# EAGLE design SDIDKII-LCD(FB4) (EAGLE 5.11)
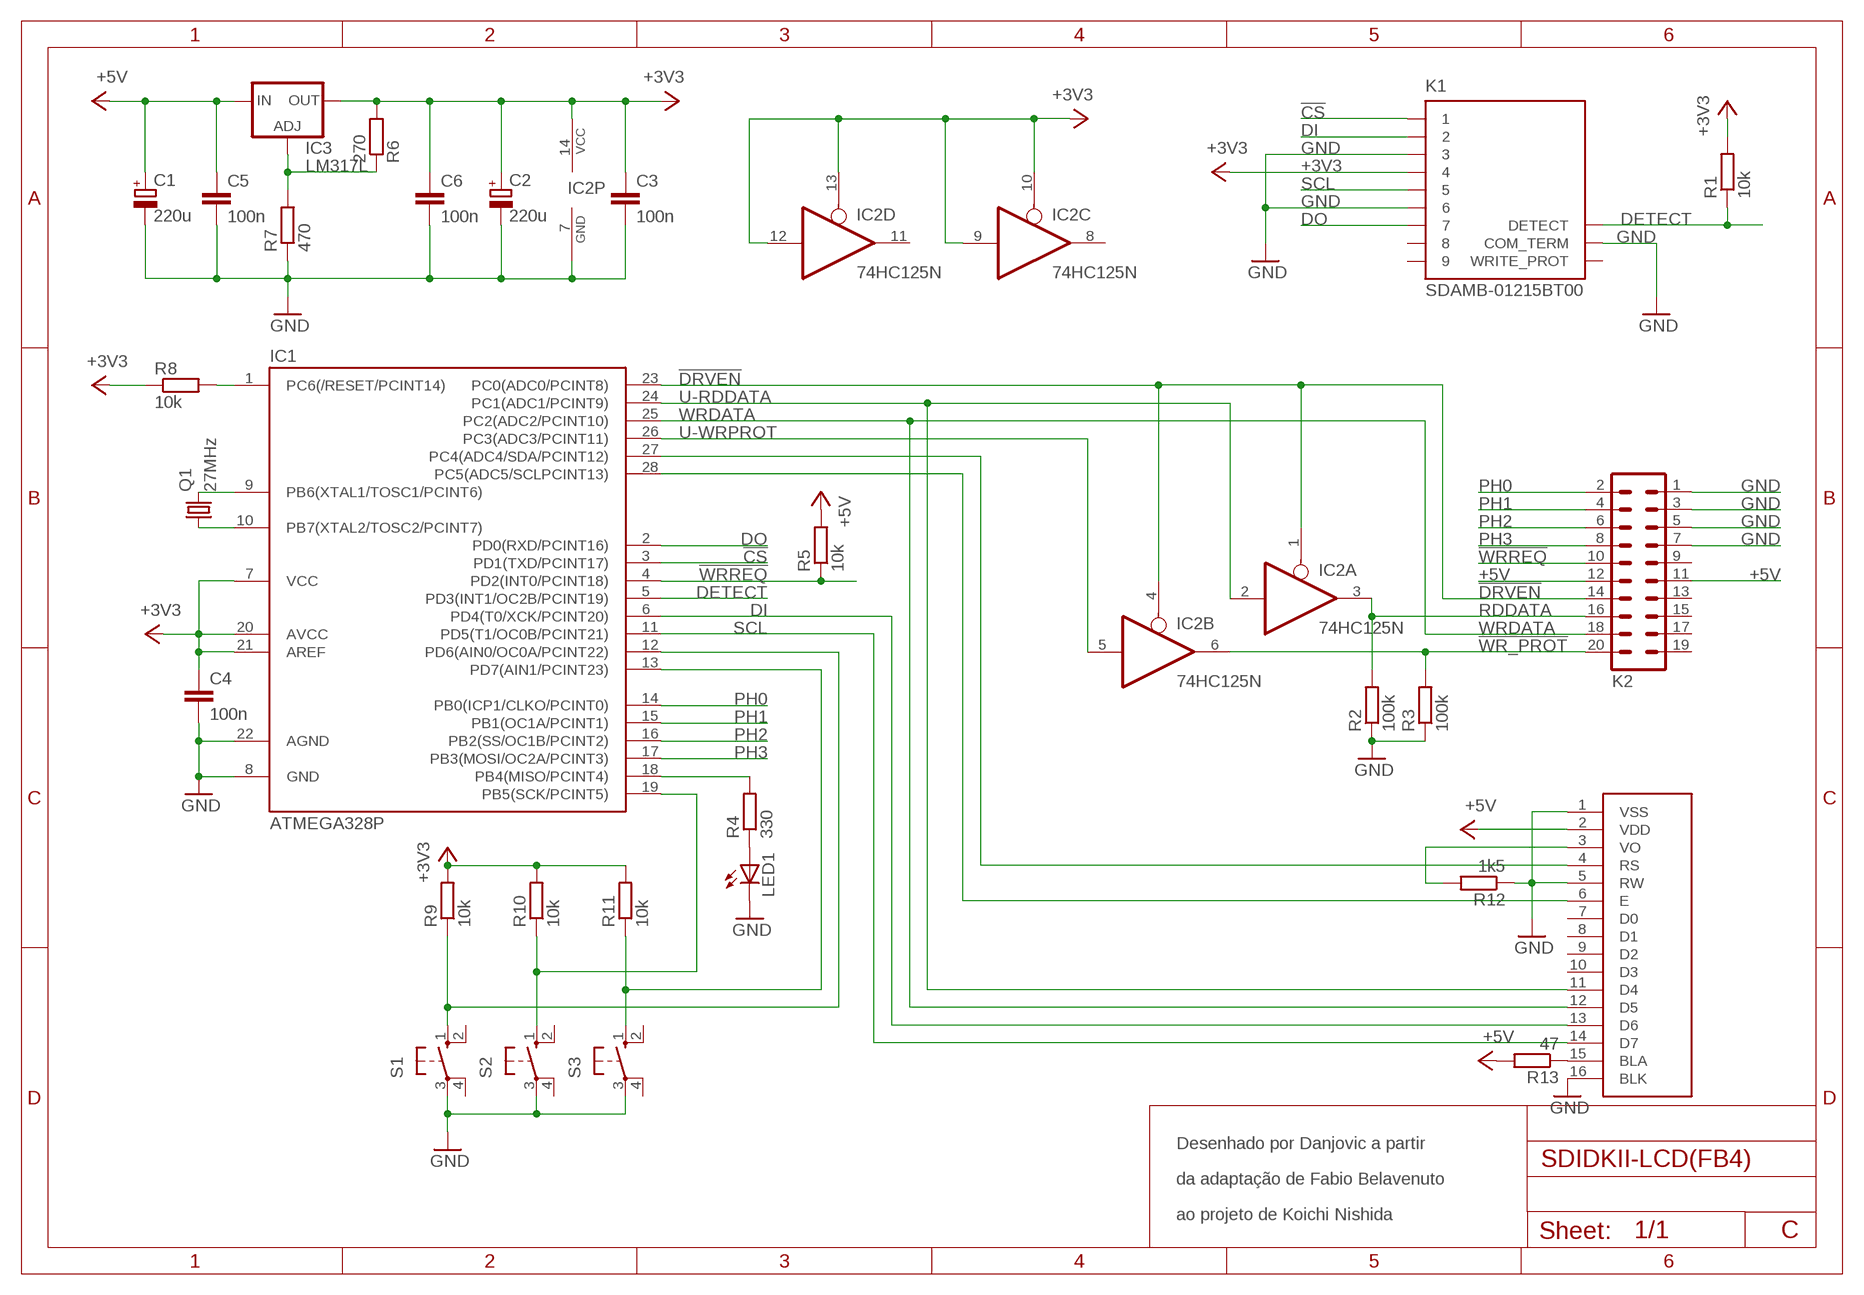
[diagram p0: schematic, sheet 1]

## Parts
C1  220u  CPOL-EUE2.5-6  [E2,5-6]
C2  220u  CPOL-EUE2.5-6  [E2,5-6]
C3  100n  C-EU050-025X075  [C050-025X075]
C4  100n  C-EU050-025X075  [C050-025X075]
C5  100n  C-EU050-025X075  [C050-025X075]
C6  100n  C-EU050-025X075  [C050-025X075]
IC1  ATMEGA328P  ATMEGA48/88/168-PU  [DIL28-3]
IC2  74HC125N  74LS125N  [DIL14]
IC3  LM317L  [317L]
K1  SDAMB-01215BT00  FPS009-3000  [FPS009-3000]
K2  ML20  [ML20]
LED1  LED3MM  [LED3MM]
Q1  27MHz  CRYSTALHC49S  [HC49/S]
R1  10k  R-EU_0207/7  [0207/7]
R2  100k  R-EU_0207/7  [0207/7]
R3  100k  R-EU_0207/7  [0207/7]
R4  330  R-EU_0207/7  [0207/7]
R5  10k  R-EU_0207/7  [0207/7]
R6  270  R-EU_0207/7  [0207/7]
R7  470  R-EU_0207/7  [0207/7]
R8  10k  R-EU_0207/7  [0207/7]
R9  10k  R-EU_0207/7  [0207/7]
R10  10k  R-EU_0207/7  [0207/7]
R11  10k  R-EU_0207/7  [0207/7]
R12  1k5  R-EU_0207/7  [0207/7]
R13  47  R-EU_0207/7  [0207/7]
S1  10-XX  [B3F-10XX]
S2  10-XX  [B3F-10XX]
S3  10-XX  [B3F-10XX]
U$1  2X16LCDTOP  [2X16LCDTOP]

## Nets
!CS: IC1.3(PD1(TXD/PCINT17)) K1.1
!DRVEN: IC1.23(PC0(ADC0/PCINT8)) IC2.1(A:OE) IC2.4(B:OE) K2.14
!WR_PROT: IC2.6(B:O) K2.20 R3.2
!WRREQ: IC1.4(PD2(INT0/PCINT18)) K2.10 R5.1
+3V3: C2.+ C3.1 C4.1 C6.1 IC1.7(VCC) IC1.20(AVCC) IC1.21(AREF) IC2.9(C:I) IC2.10(C:OE) IC2.12(D:I) IC2.13(D:OE) IC2.14(P:VCC) IC3.2(OUT) K1.4 R1.2 R6.2 R8.1 R9.2 R10.2 R11.2
+5V: C1.+ C5.1 IC3.3(IN) K2.11 K2.12 R5.2 R13.2 U$1.2(VDD)
ADJ: IC3.1(ADJ) R6.1 R7.2
DETECT: IC1.5(PD3(INT1/OC2B/PCINT19)) K1.DETECT R1.1
DI: IC1.6(PD4(T0/XCK/PCINT20)) K1.2 U$1.13(D6)
DO: IC1.2(PD0(RXD/PCINT16)) K1.7
GND: C1.- C2.- C3.2 C4.2 C5.2 C6.2 IC1.8(GND) IC1.22(AGND) IC2.7(P:GND) K1.3 K1.6 K1.COM_TERM K2.1 K2.3 K2.5 K2.7 LED1.K(C) R2.1 R3.1 R7.1 R12.1 S1.3(P) S2.3(P) S3.3(P) U$1.1(VSS) U$1.5(RW) U$1.16(BLK)
K: LED1.A R4.1
LED: IC1.18(PB4(MISO/PCINT4)) R4.2
N$1: IC1.19(PB5(SCK/PCINT5)) R10.1 S2.1(S)
N$2: IC1.13(PD7(AIN1/PCINT23)) R11.1 S3.1(S)
N$3: R13.1 U$1.15(BLA)
N$6: IC1.1(PC6(/RESET/PCINT14)) R8.2
N$8: IC1.28(PC5(ADC5/SCLPCINT13)) U$1.6(E)
N$9: IC1.27(PC4(ADC4/SDA/PCINT12)) U$1.4(RS)
N$10: R12.2 U$1.3(VO)
PH0: IC1.14(PB0(ICP1/CLKO/PCINT0)) K2.2
PH1: IC1.15(PB1(OC1A/PCINT1)) K2.4
PH2: IC1.16(PB2(SS/OC1B/PCINT2)) K2.6
PH3: IC1.17(PB3(MOSI/OC2A/PCINT3)) K2.8
RDDATA: IC2.3(A:O) K2.16 R2.2
SCL: IC1.11(PD5(T1/OC0B/PCINT21)) K1.5 U$1.14(D7)
SW: IC1.12(PD6(AIN0/OC0A/PCINT22)) R9.1 S1.1(S)
U-RDDATA: IC1.24(PC1(ADC1/PCINT9)) IC2.2(A:I) U$1.11(D4)
U-WRPROT: IC1.26(PC3(ADC3/PCINT11)) IC2.5(B:I)
WRDATA: IC1.25(PC2(ADC2/PCINT10)) K2.18 U$1.12(D5)
X1: IC1.9(PB6(XTAL1/TOSC1/PCINT6)) Q1.2
X2: IC1.10(PB7(XTAL2/TOSC2/PCINT7)) Q1.1
Unconnected: IC2.8(C:O) IC2.11(D:O) K1.8 K1.9 K1.WRITE_PROT K2.9 K2.13 K2.15 K2.17 K2.19 S1.2(S1) S1.4(P1) S2.2(S1) S2.4(P1) S3.2(S1) S3.4(P1) U$1.7(D0) U$1.8(D1) U$1.9(D2) U$1.10(D3)

## Notes on the sheet
- Desenhado por Danjovic a partir
- da adaptação de Fabio Belavenuto
- ao projeto de Koichi Nishida
- C

## Library data of the parts
C1 C2 = rcl:CPOL-EU: POLARIZED CAPACITOR, European symbol
C3-C6 = rcl:C-EU: CAPACITOR, European symbol
IC1 = atmega8:ATMEGA48/88/168-PU
IC2 = 74xx-us:74*125: Quad bus BUFFER, 3-state
IC3 = v-reg:LM317L: VOLTAGE REGULATOR
K1 = con-yamaichi:FPS009-300*: SD Card and MMC Reader (Manual Insertion) Source: http://www.yamaichi.de/pdf/c_fps009_3000.pdf; OC_FARNELL: unknown; OC_NEWARK: unknown
K2 = con-harting-ml:ML20: HARTING; OC_FARNELL: unknown; OC_NEWARK: unknown
LED1 = led:LED: LED OSRAM: - CHIPLED LG R971, LG N971, LY N971, LG Q971, LY Q971, LO R971, LY R971 LH N974, LH R974 LS Q976, LO Q976, LY Q976 LO Q996 - Hyper CHIPLED LW Q18S LB Q993, LB Q99A, LB R99A - SideLED LS A670, LO A670, LY A670, LG A670, LP A670 LB A673, LV A673, LT A673, LW A673 LH A674 LY A675 LS A676, LA A676, LO A676, LY A676, LW A676 LS A679, LY A679, LG A679 - Hyper Micro SIDELED® LS Y876, LA Y876, LO Y876, LY Y876 LT Y87S - SmartLED LW L88C, LW L88S LB L89C, LB L89S, LG L890 LS L89K, LO L89K, LY L89K LS L896, LA L896, LO L896, LY L896 - TOPLED LS T670, LO T670, LY T670, LG T670, LP T670 LSG T670, LSP T670, LSY T670, LOP T670, LYG T670 LG T671, LOG T671, LSG T671 LB T673, LV T673, LT T673, LW T673 LH T674 LS T676, LA T676, LO T676, LY T676, LB T676, LH T676, LSB T676, LW T676 LB T67C, LV T67C, LT T67C, LS T67K, LO T67K, LY T67K, LW E67C LS E67B, LA E67B, LO E67B, LY E67B, LB E67C, LV E67C, LT E67C LW T67C LS T679, LY T679, LG T679 LS T770, LO T770, LY T770, LG T770, LP T770 LB T773, LV T773, LT T773, LW T773 LH T774 LS E675, LA E675, LY E675, LS T675 LS T776, LA T776, LO T776, LY T776, LB T776 LHGB T686 LT T68C, LB T68C - Hyper Mini TOPLED® LB M676 - Mini TOPLED Santana® LG M470 LS M47K, LO M47K, LY M47K Source: http://www.osram.convergy.de LUXEON: - LUMILED® LXK2-PW12-R00, LXK2-PW12-S00, LXK2-PW14-U00, LXK2-PW14-V00 LXK2-PM12-R00, LXK2-PM12-S00, LXK2-PM14-U00 LXK2-PE12-Q00, LXK2-PE12-R00, LXK2-PE12-S00, LXK2-PE14-T00, LXK2-PE14-U00 LXK2-PB12-K00, LXK2-PB12-L00, LXK2-PB12-M00, LXK2-PB14-N00, LXK2-PB14-P00, LXK2-PB14-Q00 LXK2-PR12-L00, LXK2-PR12-M00, LXK2-PR14-Q00, LXK2-PR14-R00 LXK2-PD12-Q00, LXK2-PD12-R00, LXK2-PD12-S00 LXK2-PH12-R00, LXK2-PH12-S00 LXK2-PL12-P00, LXK2-PL12-Q00, LXK2-PL12-R00 Source: www.luxeon.com KINGBRIGHT: KA-3528ASYC Source: www.kingbright.com
Q1 = crystal:CRYSTAL: CRYSTAL; OC_FARNELL: 1667008; OC_NEWARK: unknown
R1-R13 = rcl:R-EU_: RESISTOR, European symbol
S1-S3 = switch-omron:10-XX: OMRON SWITCH; MPN: B3F-1000; OC_FARNELL: 176432; OC_NEWARK: 36M3542
U$1 = lcd_modules_ece:2X16LCDTOP

## Board
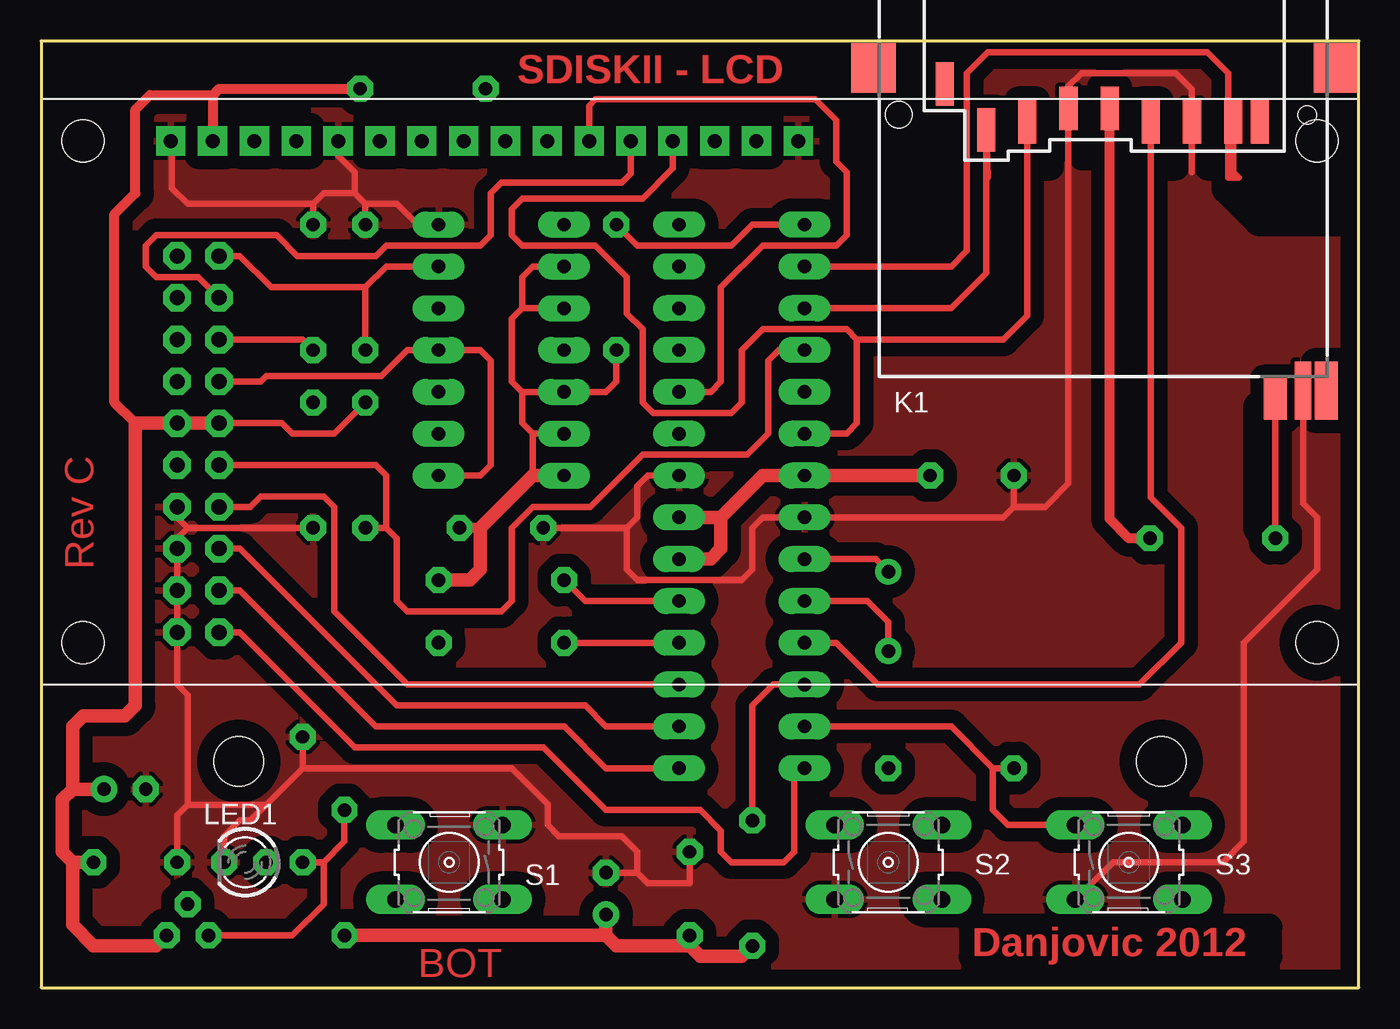
[diagram p1: board, top side]
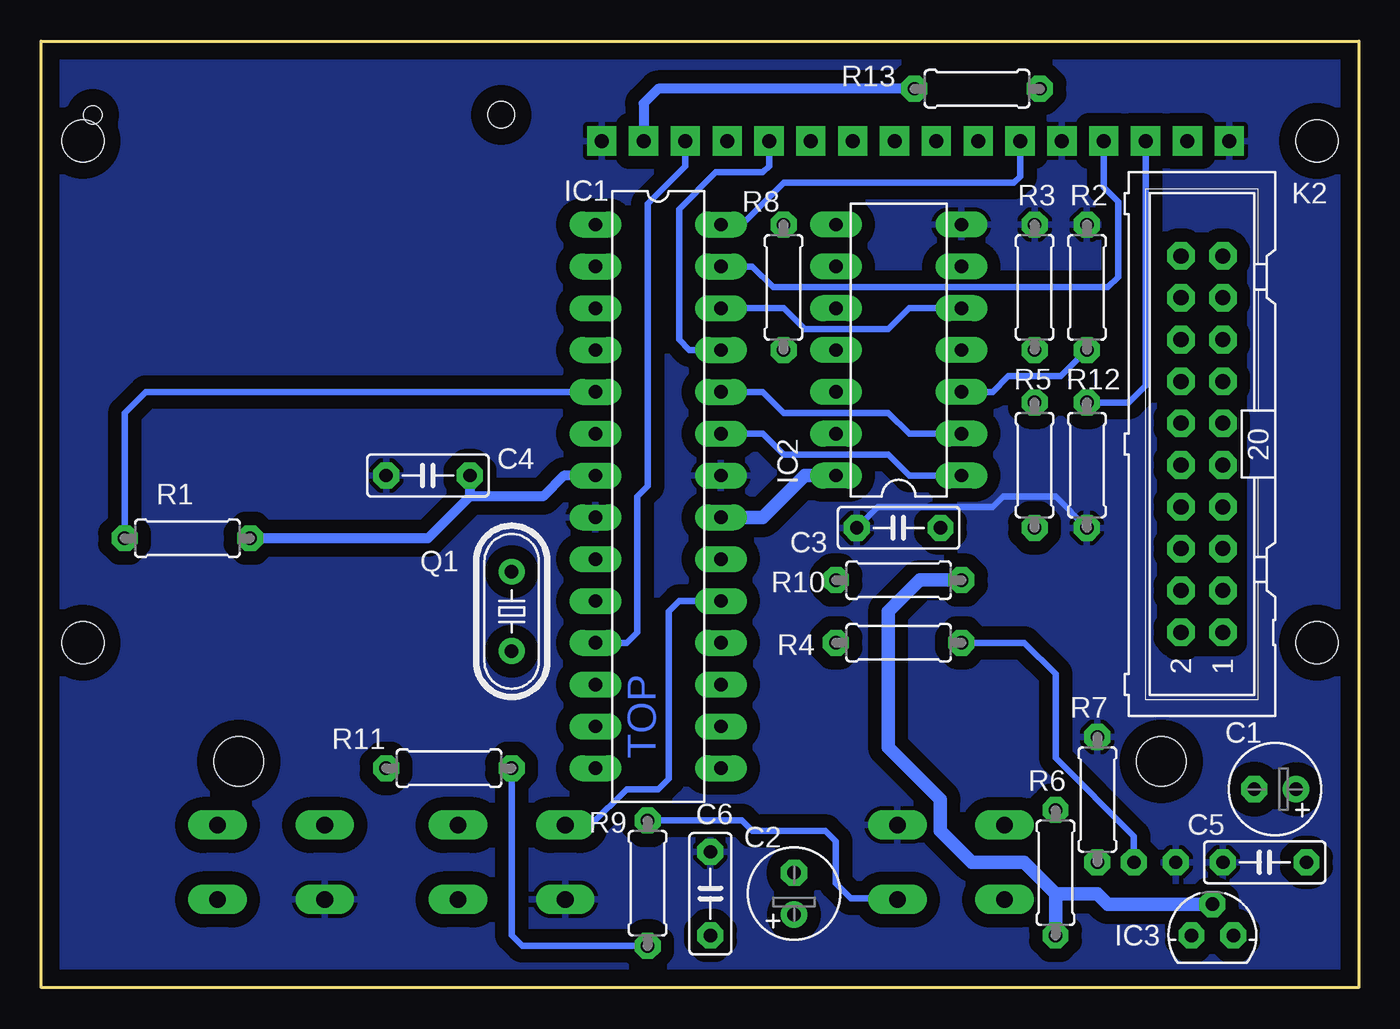
[diagram p2: board, bottom side, seen from below]

Size 80 x 57.5 mm. Coordinates in mm from the lower left corner, seen from the top.
Outline: 0,0 80,0 80,57.5 0,57.5 0,0
Copper layers (1*16): Top 0.035mm / dielectric 1.5mm / Bottom 0.035mm
Design rules "default *": minimum track width 10mil, minimum drill 24mil, track to track 8mil, track to pad 8mil, pad to pad 8mil, via to via 8mil, smd to smd 8mil, copper to edge 40mil, drill to drill 8mil, minimum pad ring 15mil, minimum via ring 8mil, stop-mask expansion 4mil, vias tented up to drill 0mil, thermal gap 10mil
Holes 3 mm at 12,13.75 68,13.75
tRestrict: area 58.1,49.2 to 58.7,51.8; area 60.6,49.8 to 61.3,53; area 63.2,50.5 to 63.8,53; area 68.3,49.8 to 68.9,53; area 70.8,49.8 to 71.4,53; area 65.7,49.8 to 66.4,53.7; 6 lines
bRestrict: area 7.6,21 to 11.4,45.1; area 5.7,11.4 to 7,12.7; area 33.7,6.4 to 34.9,7.6
vRestrict: area 5.1,16.5 to 14.6,49.5; area 56.5,25.4 to 80,54

### Footprints (pad centres in the part's own frame; a part is rotated, then mirrored left to right if it is on the bottom)
E2,5-6 = drill 0.813 pad 1.6 round: + -1.27,0 | drill 0.813 pad 1.6 octagon: - 1.27,0
C050-025X075 = drill 0.813 octagon: 1 -2.54,0; 2 2.54,0
DIL28-3 = drill 0.813 long: 1 -16.51,-3.81; 2 -13.97,-3.81; 3 -11.43,-3.81; 4 -8.89,-3.81; 5 -6.35,-3.81; 6 -3.81,-3.81; 7 -1.27,-3.81; 8 1.27,-3.81; 9 3.81,-3.81; 10 6.35,-3.81; 11 8.89,-3.81; 12 11.43,-3.81; 13 13.97,-3.81; 14 16.51,-3.81; 15 16.51,3.81; 16 13.97,3.81; 17 11.43,3.81; 18 8.89,3.81; 19 6.35,3.81; 20 3.81,3.81; 21 1.27,3.81; 22 -1.27,3.81; 23 -3.81,3.81; 24 -6.35,3.81; 25 -8.89,3.81; 26 -11.43,3.81; 27 -13.97,3.81; 28 -16.51,3.81
DIL14 = drill 0.813 long: 1 -7.62,-3.81; 2 -5.08,-3.81; 3 -2.54,-3.81; 4 0,-3.81; 5 2.54,-3.81; 6 5.08,-3.81; 7 7.62,-3.81; 8 7.62,3.81; 9 5.08,3.81; 10 2.54,3.81; 11 0,3.81; 12 -2.54,3.81; 13 -5.08,3.81; 14 -7.62,3.81
317L = drill 0.813 octagon: 1 -1.27,0; 2 0,1.905; 3 1.27,0
FPS009-3000 = smd 2.65 x 1.1: 1 -0.915,-5.3; 2 -0.415,-7.8; 3 0.385,-10.3; 4 0.385,-12.8; 5 -0.415,-15.3; 6 -0.415,-17.8; 7 -0.415,-20.3; 8 -0.415,-21.925; 9 1.885,-2.8 | smd 3.5 x 1: COM_TERM -16.75,-24.55 | smd 2.5 x 1.4: DETECT -17.25,-22.85 | smd 3 x 2.7: M1 2.85,1.55; M2 2.85,-26.55 | smd 3.5 x 1.4: WRITE_PROT -16.75,-25.95 | hole 1.6: 0,0 | hole 1.1: 0,-24.8
ML20 = drill 0.914 octagon: 1 -11.43,-1.27; 2 -11.43,1.27; 3 -8.89,-1.27; 4 -8.89,1.27; 5 -6.35,-1.27; 6 -6.35,1.27; 7 -3.81,-1.27; 8 -3.81,1.27; 9 -1.27,-1.27; 10 -1.27,1.27; 11 1.27,-1.27; 12 1.27,1.27; 13 3.81,-1.27; 14 3.81,1.27; 15 6.35,-1.27; 16 6.35,1.27; 17 8.89,-1.27; 18 8.89,1.27; 19 11.43,-1.27; 20 11.43,1.27
LED3MM = drill 0.813 octagon: A -1.27,0; K 1.27,0
HC49/S = drill 0.813 round: 1 -2.413,0; 2 2.413,0
0207/7 = drill 0.813 octagon: 1 -3.81,0; 2 3.81,0
B3F-10XX = drill 1.016 long: 1 -3.251,2.261; 2 3.251,2.261; 3 -3.251,-2.261; 4 3.251,-2.261
2X16LCDTOP = drill 0.85 pad 1.778 square: 1 7.87,33.02; 2 10.41,33.02; 3 12.95,33.02; 4 15.49,33.02; 5 18.03,33.02; 6 20.57,33.02; 7 23.11,33.02; 8 25.65,33.02; 9 28.19,33.02; 10 30.73,33.02; 11 33.27,33.02; 12 35.81,33.02; 13 38.35,33.02; 14 40.89,33.02; 15 43.43,33.02; 16 45.97,33.02 | hole 2.54: 2.54,33.02; 77.47,33.02; 77.47,2.54; 2.54,2.54

### Placement (x,y rotation side)
C1  5.08,12.06 180 bottom
C2  34.29,5.71 90 bottom
C3  27.94,27.94 180 bottom
C4  56.52,31.11 180 bottom
C5  5.71,7.62 180 bottom
C6  39.37,5.71 90 bottom
IC1  42.55,29.84 270 bottom
IC2  27.94,38.73 90 bottom
IC3  8.89,3.17 0 bottom
K1  52.07,53.02 90 top
K2  9.53,33.02 90 bottom
LED1  12.38,7.62 180 top
Q1  51.44,22.86 90 bottom
R1  71.12,27.3 0 bottom
R2  16.51,42.55 270 bottom
R3  19.68,42.55 270 bottom
R4  27.94,20.95 180 bottom
R5  19.68,31.75 90 bottom
R6  18.41,6.99 270 bottom
R7  15.88,11.43 270 bottom
R8  34.92,42.55 90 bottom
R9  43.18,6.35 270 bottom
R10  27.94,24.77 0 bottom
R11  55.24,13.34 0 bottom
R12  16.51,31.75 90 bottom
R13  23.18,54.61 0 bottom
S1  24.77,7.62 180 top
S2  51.44,7.62 0 top
S3  66.04,7.62 0 top
U$1  0,18.41 0 top

### Tracks (layer width: path | path; a pad name or v marks a point on that pad's centre or on a via)
!CS
  Top 0.406: 57.47,49.21 K1.1 57.37,43.4 55.24,41.27 IC1.3
!DRVEN
  Top 0.406: K2.14 13.34,36.83 13.65,37.15 20.64,37.15 22.23,38.73 IC2.4 26.67,38.73 27.3,38.1 27.3,31.75 26.67,31.11 IC2.1
  Bottom 0.406: IC2.1 27.3,31.11 28.57,32.38 34.92,32.38 36.2,33.66 IC1.23
!WR_PROT
  Top 0.406: 19.68,42.55 R3.2 | 19.68,42.55 20.95,43.81 IC2.6 | K2.20 12.06,44.45 13.97,42.55 19.68,42.55
!WRREQ
  Top 0.406: IC1.4 44.77,38.73 44.13,38.1 44.13,33.66 42.86,32.38 36.51,32.38 33.34,29.21 29.84,29.21 28.57,27.94 28.57,23.5 27.94,22.86 22.23,22.86 21.59,23.5 21.59,27.3 20.95,27.94 | 20.95,27.94 20.95,31.11 20.32,31.75 K2.10 | 20.95,27.94 R5.1
+3V3
  Top 0.406: 29.21,41.27 IC2.10 | 29.21,41.27 29.21,43.18 29.84,43.81 IC2.9 | R8.1 34.92,36.83 34.29,36.2 IC2.12 29.21,36.2 | K1.4 64.77,50.8 | 29.84,33.66 IC2.13 | 29.84,31.11 29.84,33.66 | 29.21,36.2 29.21,34.29 29.84,33.66 | 29.21,36.2 28.57,36.83 28.57,40.64 29.21,41.27
  Top 0.61: 26.67,27.94 C3.1 | K1.4 64.87,28.48 66.04,27.3 R1.2
  Top 0.813: IC1.20 40.64,26.04 41.27,26.67 41.27,28.57 | IC1.21 41.27,28.57 | 41.27,28.57 43.81,31.11 IC1.7 C4.1 | R9.2 42.55,1.91 40.01,1.91 39.37,2.54 | 39.37,2.54 34.92,2.54 34.29,3.17 | R6.2 34.29,3.17 | 34.29,3.17 C2.+ | 39.37,2.54 C6.1 | R10.2 26.04,24.77 26.67,25.4 26.67,27.94 29.84,31.11 IC2.14
  Bottom 0.406: R9.2 50.8,2.54 51.44,3.17 R11.2
  Bottom 0.61: R1.2 56.52,27.3 53.98,29.84 | C4.1 53.98,29.84 | IC1.7 48.26,31.11 49.53,29.84 53.98,29.84
  Bottom 0.813: IC3.2 15.24,5.08 15.88,5.71 18.41,5.71 | 18.41,5.71 R6.2 | R10.2 26.67,24.77 28.57,22.86 28.57,14.61 25.4,11.43 25.4,9.53 23.5,7.62 20.32,7.62 18.41,5.71 | IC2.14 33.66,31.11 36.2,28.57 IC1.21
+5V
  Top 0.406: K2.12 14.61,34.29 15.24,33.66 17.78,33.66 R5.2
  Top 0.61: 5.71,34.29 4.45,35.56 4.45,46.99 5.71,48.26 5.71,53.34 6.6,54.23 10.41,54.23 | 10.41,54.23 U$1.2 | 10.41,54.23 10.79,54.61 R13.2
  Top 0.813: K2.12 K2.11 5.71,34.29 5.71,17.14 5.08,16.51 2.54,16.51 1.91,15.88 1.91,12.06 | 1.91,7.62 1.27,8.26 1.27,11.43 1.91,12.06 | IC3.3 6.99,2.54 3.17,2.54 1.91,3.81 1.91,7.62 | 1.91,12.06 C1.+ | 1.91,7.62 C5.1
ADJ
  Top 0.406: IC3.1 15.24,3.17 17.14,5.08 17.14,7.62 | 17.14,7.62 18.41,8.89 R6.1 | 17.14,7.62 R7.2
DETECT
  Top 0.406: K1.DETECT 74.93,32.38 R1.1
  Bottom 0.406: IC1.5 73.66,36.2 74.93,34.92 R1.1
DI
  Top 0.406: IC1.6 48.9,33.66 49.53,34.29 49.53,39.37 | 49.53,39.37 48.9,40.01 43.81,40.01 42.55,38.73 42.55,35.56 41.91,34.92 37.15,34.92 36.51,35.56 36.51,40.01 35.56,40.96 35.56,43.18 33.66,45.09 29.21,45.09 28.57,45.72 28.57,47.31 29.21,47.94 36.51,47.94 38.35,49.78 U$1.13 | 49.53,39.37 58.42,39.37 59.87,40.82 K1.2
DO
  Top 0.406: K1.7 72.39,49.53 72.71,49.21 72.07,49.21 72.07,55.56 70.8,56.83 57.47,56.83 56.2,55.56 56.2,44.77 55.24,43.81 IC1.2
GND
  Top 0.406: 69.85,49.53 K1.6 69.87,54.59 68.9,55.56 63.18,55.56 62.37,54.75 K1.3 62.37,30.62 60.96,29.21 59.05,29.21 | U$1.1 7.94,51.44 7.94,48.58 8.89,47.62 16.51,47.62 | 8.89,27.94 8.26,28.57 K2.7 | 8.89,27.94 8.26,27.3 K2.5 K2.3 K2.1 8.26,18.41 8.89,17.78 8.89,11.11 | 8.89,27.94 R12.1 | C6.2 39.37,6.35 36.83,6.35 36.2,6.99 | 36.2,6.99 C2.- | 36.2,6.99 36.2,8.26 35.24,9.21 31.43,9.21 30.76,9.88 30.76,11.15 28.57,13.34 15.88,13.34 | 16.51,47.62 R2.1 | 16.51,47.62 17.14,48.26 19.05,48.26 | 19.05,48.26 19.68,47.62 | 19.68,47.62 R3.1 | U$1.5 18.03,50.55 19.05,49.53 19.05,48.26 | IC2.7 22.86,46.35 21.59,47.62 19.68,47.62 | IC1.22 36.83,31.11 36.2,30.48 36.2,28.57 35.56,27.94 | C3.2 35.56,27.94 | 35.56,27.94 35.56,25.4 36.2,24.77 42.55,24.77 43.18,25.4 43.18,27.94 43.81,28.57 IC1.8 58.42,28.57 59.05,29.21 | 15.88,13.34 R7.1 | 13.65,11.11 12.7,10.16 12.06,10.16 11.11,9.21 LED1.K | 13.65,11.11 15.88,13.34 | C5.2 8.26,10.48 8.89,11.11 | 8.89,11.11 13.65,11.11 | K1.COM_TERM 76.62,29.43 77.47,28.57 77.47,25.4 73.03,20.95 73.03,8.89 71.75,7.62 65.09,7.62 64.45,6.99 64.41,6.99 S3.3 | 59.05,29.21 C4.2
  Bottom 0.406: R12.1 18.41,29.84 21.59,29.84 22.23,29.21 29.21,29.21 C3.2
  pour Bottom (isolate 0.813): -0.64,58.42 -0.64,-0.64 82.28,-1.27 82.28,57.78
  pour Top (isolate 0.813): -0.64,59.05 -0.64,-0.64 81.28,-0.64 81.28,59.05
K
  Bottom 0.406: LED1.A 13.65,9.21 18.41,13.97 18.41,19.05 20.32,20.95 R4.1
LED
  Top 0.406: R4.2 IC1.18
N$1
  Top 0.406: R10.1 33.02,23.5 IC1.19
  Bottom 0.406: IC1.19 41.27,23.5 41.91,22.86 41.91,12.7 42.55,12.06 44.45,12.06 46.63,9.88 S2.1
N$2
  Top 0.406: IC1.13 55.24,15.88 57.78,13.34 | 57.78,13.34 R11.1 | S3.1 58.7,9.88 57.78,10.79 57.78,13.34
N$3
  Bottom 0.61: U$1.15 43.43,53.73 42.55,54.61 R13.1
N$6
  Top 0.406: R8.2 36.2,45.09 41.91,45.09 43.18,46.35 IC1.1
N$8
  Bottom 0.406: U$1.6 20.57,49.28 20.95,48.9 34.92,48.9 37.47,46.35 IC1.28
N$9
  Bottom 0.406: IC1.27 36.83,43.81 35.56,42.55 15.24,42.55 14.61,43.18 14.61,47.76 15.49,48.65 U$1.4
N$10
  Bottom 0.406: U$1.3 12.95,36.58 13.97,35.56 R12.2
PH0
  Top 0.406: K2.2 12.06,21.59 19.05,14.61 30.48,14.61 34.29,10.79 40.01,10.79 41.27,9.53 41.27,8.26 41.91,7.62 45.09,7.62 45.72,8.26 45.72,12.7 IC1.14
PH1
  Top 0.406: K2.4 12.06,24.13 20.32,15.88 31.75,15.88 34.29,13.34 IC1.15
PH2
  Top 0.406: K2.6 12.06,26.67 21.59,17.14 33.02,17.14 34.29,15.88 IC1.16
PH3
  Top 0.406: IC1.17 22.23,18.41 17.78,22.86 17.78,29.21 17.14,29.84 13.34,29.84 12.7,29.21 K2.8
RDDATA
  Top 0.406: R2.2 15.88,39.37 K2.16
  Bottom 0.406: R2.2 18.1,37.15 21.27,37.15 22.23,36.2 IC2.3
SCL
  Top 0.406: K1.5 67.37,29.79 69.22,27.94 69.22,20.95 66.67,18.41 50.8,18.41 48.26,20.95 IC1.11
  Bottom 0.406: IC1.11 44.45,20.95 43.81,21.59 43.81,29.84 43.18,30.48 43.18,47.62 40.89,49.91 U$1.14
SW
  Top 0.406: R9.1 43.18,17.14 44.45,18.41 IC1.12
  Bottom 0.406: R9.1 37.47,10.16 36.83,9.53 32.38,9.53 31.75,8.89 31.75,6.35 31.11,5.71 30.84,5.44 29.49,5.44 S1.1
U-RDDATA
  Top 0.406: IC1.24 40.64,36.2 41.27,36.83 41.27,42.55 43.81,45.09 48.26,45.09 48.9,45.72 48.9,49.53 48.26,50.16 48.26,52.7 46.99,53.98 33.66,53.98 33.27,53.59 U$1.11
  Bottom 0.406: IC2.2 27.3,33.66 28.57,34.92 34.92,34.92 36.2,36.2 IC1.24
U-WRPROT
  Bottom 0.406: IC1.26 34.92,41.27 33.66,40.01 28.57,40.01 27.3,41.27 IC2.5
WRDATA
  Top 0.406: K2.18 9.53,43.18 6.99,43.18 6.35,43.81 6.35,45.09 6.99,45.72 14.29,45.72 15.56,44.45 20.32,44.45 20.95,45.09 26.67,45.09 27.3,45.72 27.3,48.26 27.94,48.9 35.24,48.9 35.81,49.46 U$1.12
  Bottom 0.406: IC1.25 40.64,38.73 41.27,39.37 41.27,47.31 39.05,49.53 36.2,49.53 35.81,49.91 U$1.12
X1
  Top 0.406: IC1.9 50.67,26.04 Q1.2
X2
  Top 0.406: IC1.10 50.16,23.5 51.44,22.23 Q1.1

### Text on the board
Top: SDISKII - LCD | Rev C | Danjovic 2012 | BOT
Bottom: TOP